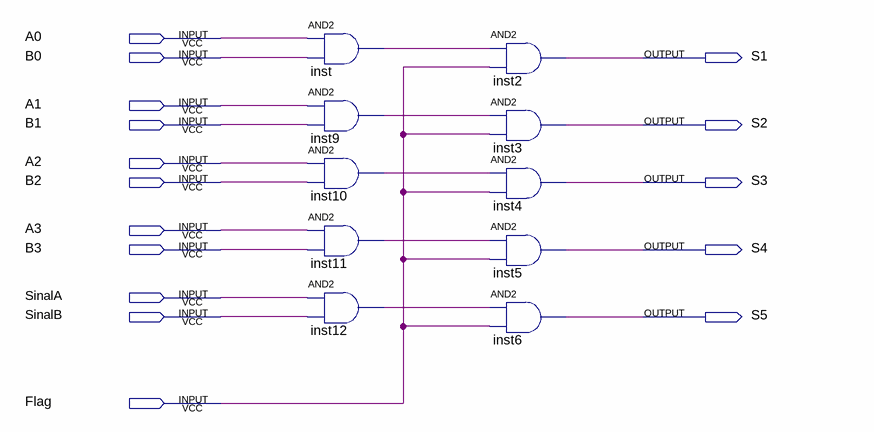
[diagram p0: schematic sheet]
// Quartus schematic AND1.bdf as structural Verilog: 10 symbols, 16 pins
module AND1 (
  input  A0,
  input  B0,
  input  A1,
  input  B1,
  input  A2,
  input  B2,
  input  A3,
  input  B3,
  input  SinalA,
  input  SinalB,
  input  Flag,
  output S1,
  output S2,
  output S3,
  output S4,
  output S5
);

  wire inst9_out, inst10_out, inst11_out, inst12_out, inst_out;

  and inst (inst_out, A0, B0);
  and inst9 (inst9_out, A1, B1);
  and inst10 (inst10_out, A2, B2);
  and inst11 (inst11_out, A3, B3);
  and inst12 (inst12_out, SinalA, SinalB);
  and inst2 (S1, inst_out, Flag);
  and inst3 (S2, inst9_out, Flag);
  and inst4 (S3, inst10_out, Flag);
  and inst5 (S4, inst11_out, Flag);
  and inst6 (S5, inst12_out, Flag);
endmodule
